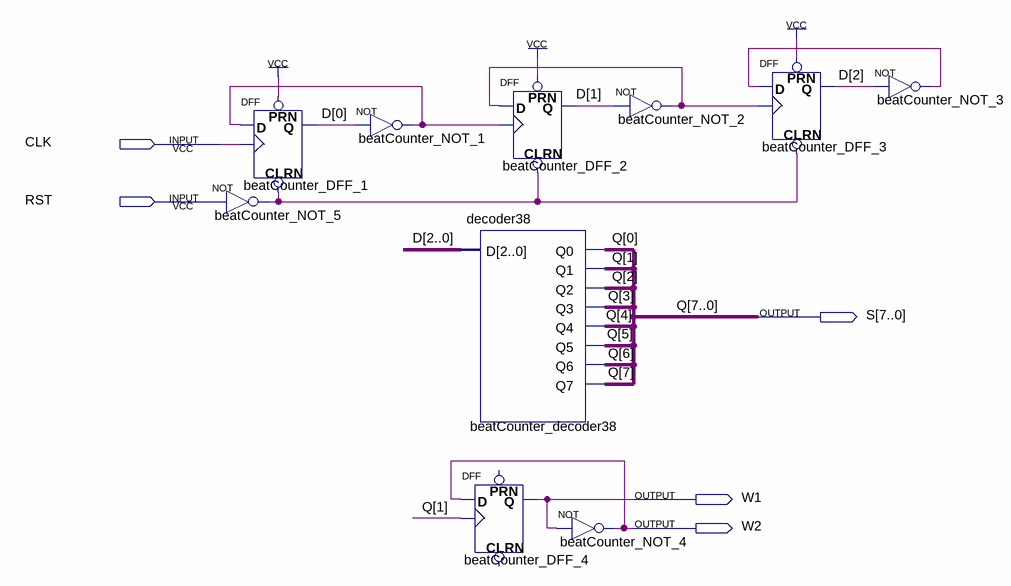
[diagram p0: schematic sheet]
// Quartus schematic beatCounter.bdf as structural Verilog: 10 symbols, 5 pins
module beatCounter (
  input  CLK,
  input  RST,
  output [7:0] S,
  output W1,
  output W2
);

  wire beatCounter_NOT_1_out, beatCounter_NOT_2_out, beatCounter_NOT_3_out, beatCounter_NOT_5_out;
  wire [2:0] D;

  DFF beatCounter_DFF_1 (.CLRN(beatCounter_NOT_5_out), .CLK(CLK), .D(beatCounter_NOT_1_out), .PRN(1'b1), .Q(D[0]));
  not beatCounter_NOT_5 (beatCounter_NOT_5_out, RST);
  not beatCounter_NOT_1 (beatCounter_NOT_1_out, D[0]);
  decoder38 beatCounter_decoder38 (
    .D(D), .Q0(S[0]), .Q1(S[1]), .Q2(S[2]), .Q3(S[3]), .Q4(S[4]), .Q5(S[5]), .Q6(S[6]), .Q7(S[7]));
  DFF beatCounter_DFF_4 (.CLK(S[1]), .D(W2), .Q(W1));  // open: CLRN, PRN
  DFF beatCounter_DFF_2 (
    .CLRN(beatCounter_NOT_5_out), .CLK(beatCounter_NOT_1_out), .D(beatCounter_NOT_2_out), .PRN(1'b1), .Q(D[1]));
  not beatCounter_NOT_2 (beatCounter_NOT_2_out, D[1]);
  not beatCounter_NOT_4 (W2, W1);
  DFF beatCounter_DFF_3 (
    .CLRN(beatCounter_NOT_5_out), .CLK(beatCounter_NOT_2_out), .D(beatCounter_NOT_3_out), .PRN(1'b1), .Q(D[2]));
  not beatCounter_NOT_3 (beatCounter_NOT_3_out, D[2]);

  // Other names for the same wires on the sheet: Q[7:0] = S
endmodule
